# EAGLE schematic udi (EAGLE 7.2.0)
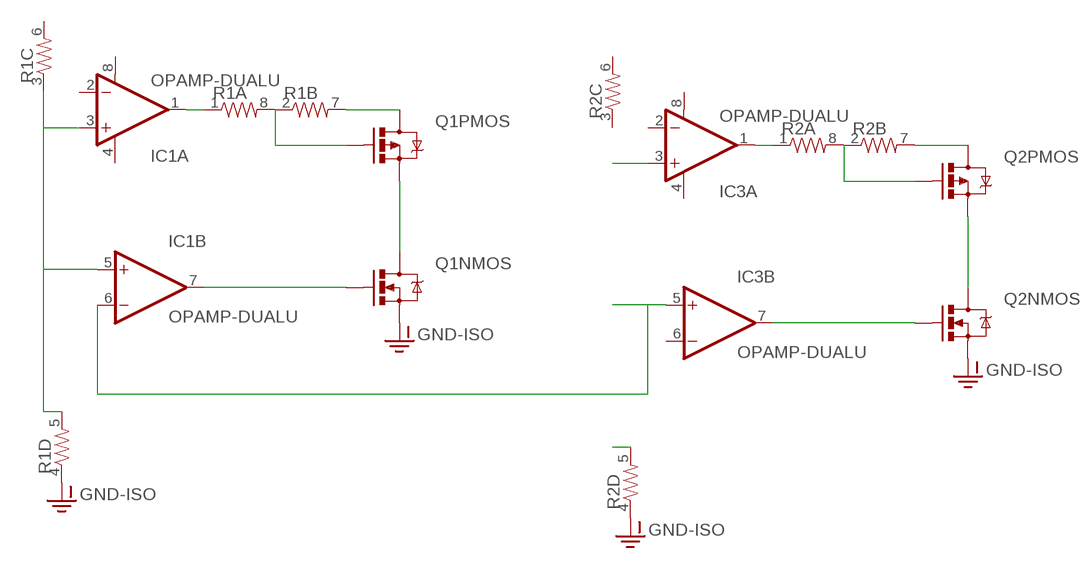
[diagram p0: schematic, sheet 1]

## Parts
IC1  OPAMP-DUALU  [SO08]
IC3  OPAMP-DUALU  [SO08]
Q1  IRF7509  [MSOP8]
Q2  IRF7509  [MSOP8]
R1  RESISTOR-ARRAY0603-ARV  [0603-ARV]
R2  RESISTOR-ARRAY0603-ARV  [0603-ARV]

## Nets
GND-ISO: Q1.1(NMOS:S) Q2.1(NMOS:S) R1.4 R2.4
N$1: IC1.1(A:OUT) R1.1
N$2: Q1.4(PMOS:G) R1.2 R1.8
N$3: IC1.3(A:+IN) IC1.5(B:+IN) R1.3 R1.5
N$4: Q1.5(PMOS:D) Q1.6(PMOS:D) R1.7
N$5: Q1.3(PMOS:S) Q1.7(NMOS:D) Q1.8(NMOS:D)
N$6: IC1.7(B:OUT) Q1.2(NMOS:G)
N$7: IC3.1(A:OUT) R2.1
N$8: Q2.4(PMOS:G) R2.2 R2.8
N$9: IC1.6(B:-IN) IC3.5(B:+IN)
N$10: Q2.5(PMOS:D) Q2.6(PMOS:D) R2.7
N$11: Q2.3(PMOS:S) Q2.7(NMOS:D) Q2.8(NMOS:D)
N$12: IC3.7(B:OUT) Q2.2(NMOS:G)
N$13: IC3.3(A:+IN)
N$14: R2.5
Unconnected: IC1.2(A:-IN) IC3.2(A:-IN) IC3.6(B:-IN) R1.6 R2.3 R2.6

## Power pins joined to a net without a drawn wire
V+: IC1.8(A:V+) IC3.8(A:V+)
V-: IC1.4(A:V-) IC3.4(A:V-)

## Library data of the parts
IC1 IC3 = SparkFun-AnalogIC:OPAMP-DUAL: Generic op-amp footprint
Q1 Q2 = SparkFun-DiscreteSemi:IRF7509: 30V Dual PMOS/NMOS MSOP-8 NMOS RDS .11-ohm PMOS RDS .20-ohm TRANS-07913; PROD_ID: TRANS-07913
R1 R2 = SparkFun-Passives:RESISTOR-ARRAY: Array Chip Resistor Source: RS Component / Phycomp